# EAGLE design Scott (EAGLE 6.6.0)
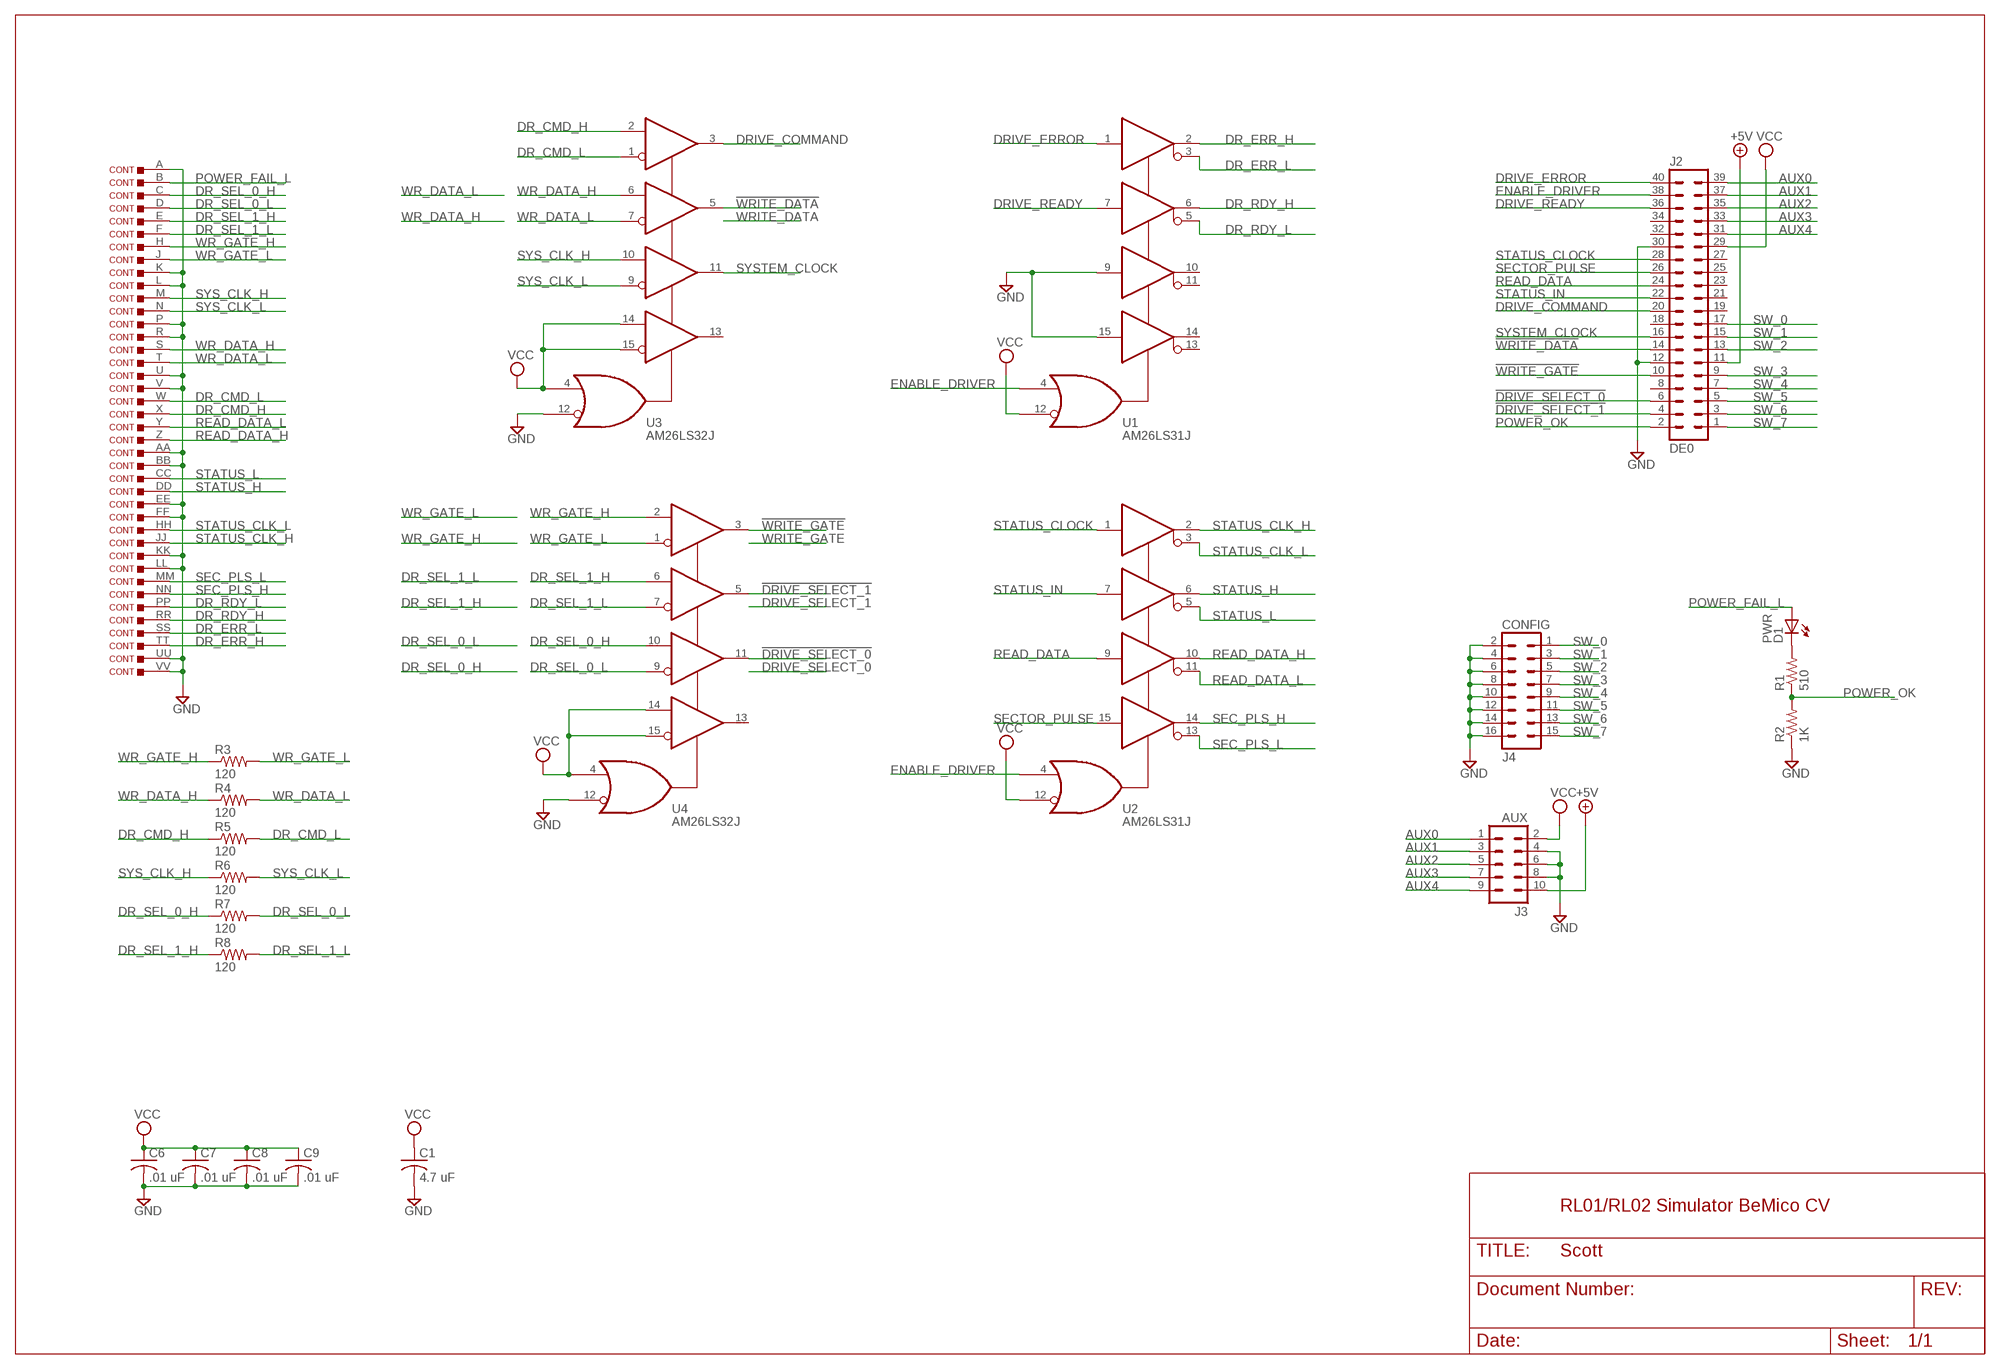
[diagram p0: schematic, sheet 1]

## Parts
C1  4.7 uF  C-USC1210K  [C1210K]
C6  .01 uF  C-USC0805  [C0805]
C7  .01 uF  C-USC0805  [C0805]
C8  .01 uF  C-USC0805  [C0805]
C9  .01 uF  C-USC0805  [C0805]
CONT  DEC40PINSV  [DEC40PINV]
D1  PWR  LEDSML0805  [SML0805]
J2  DE0  MA20-2  [MA20-2]
J3  AUX  MA05-2  [MA05-2]
J4  CONFIG  MA08-2  [MA08-2]
R1  510  R-US_M0805  [M0805]
R2  1K  R-US_M0805  [M0805]
R3  120  R-US_0204/2V  [0204V]
R4  120  R-US_0204/2V  [0204V]
R5  120  R-US_0204/2V  [0204V]
R6  120  R-US_0204/2V  [0204V]
R7  120  R-US_0204/2V  [0204V]
R8  120  R-US_0204/2V  [0204V]
U1  AM26LS31J  [SO16]
U2  AM26LS31J  [SO16]
U3  AM26LS32J  [SO16]
U4  AM26LS32J  [SO16]

## Nets
!DRIVE_SELECT_0: J2.6 U4.11(Y3)
!DRIVE_SELECT_1: J2.4 U4.5(Y2)
!WRITE_DATA: J2.14 U3.5(Y2)
!WRITE_GATE: J2.10 U4.3(Y1)
+5V: J2.11 J3.10
AUX0: J2.39 J3.1
AUX1: J2.37 J3.3
AUX2: J2.35 J3.5
AUX3: J2.33 J3.7
AUX4: J2.31 J3.9
DR_CMD_H: CONT.X R5.1 U3.2(P1)
DR_CMD_L: CONT.W R5.2 U3.1(N1)
DR_ERR_H: CONT.TT U1.2(Y1)
DR_ERR_L: CONT.SS U1.3(Z1)
DR_RDY_H: CONT.RR U1.6(Y2)
DR_RDY_L: CONT.PP U1.5(Z2)
DR_SEL_0_H: CONT.C R7.1 U4.10(P3)
DR_SEL_0_L: CONT.D R7.2 U4.9(N3)
DR_SEL_1_H: CONT.E R8.1 U4.6(P2)
DR_SEL_1_L: CONT.F R8.2 U4.7(N2)
DRIVE_COMMAND: J2.20 U3.3(Y1)
DRIVE_ERROR: J2.40 U1.1(A1)
DRIVE_READY: J2.36 U1.7(A2)
ENABLE_DRIVER: J2.38 U1.4(G) U2.4(G)
GND [supply]: C1.2 C6.2 C7.2 C8.2 C9.2 CONT.A CONT.AA CONT.BB CONT.EE CONT.FF CONT.K CONT.KK CONT.L CONT.LL CONT.P CONT.R CONT.U CONT.UU CONT.V CONT.VV J2.12 J2.30 J3.4 J3.6 J3.8 J4.2 J4.4 J4.6 J4.8 J4.10 J4.12 J4.14 J4.16 R2.1 U1.9(A3) U1.15(A4) U3.12(!G) U4.12(!G)
N$1: D1.C R1.2
POWER_FAIL_L: CONT.B D1.A
POWER_OK: J2.2 R1.1 R2.2
READ_DATA: J2.24 U2.9(A3)
READ_DATA_H: CONT.Z U2.10(Y3)
READ_DATA_L: CONT.Y U2.11(Z3)
SEC_PLS_H: CONT.NN U2.14(Y4)
SEC_PLS_L: CONT.MM U2.13(Z4)
SECTOR_PULSE: J2.26 U2.15(A4)
STATUS_CLK_H: CONT.JJ U2.2(Y1)
STATUS_CLK_L: CONT.HH U2.3(Z1)
STATUS_CLOCK: J2.28 U2.1(A1)
STATUS_H: CONT.DD U2.6(Y2)
STATUS_IN: J2.22 U2.7(A2)
STATUS_L: CONT.CC U2.5(Z2)
SW_0: J2.17 J4.1
SW_1: J2.15 J4.3
SW_2: J2.13 J4.5
SW_3: J2.9 J4.7
SW_4: J2.7 J4.9
SW_5: J2.5 J4.11
SW_6: J2.3 J4.13
SW_7: J2.1 J4.15
SYS_CLK_H: CONT.M R6.1 U3.10(P3)
SYS_CLK_L: CONT.N R6.2 U3.9(N3)
SYSTEM_CLOCK: J2.16 U3.11(Y3)
VCC [supply]: C1.1 C6.1 C7.1 C8.1 C9.1 J2.29 J3.2 U1.12(!G) U2.12(!G) U3.4(G) U3.14(P4) U3.15(N4) U4.4(G) U4.14(P4) U4.15(N4)
WR_DATA_H: CONT.S R4.1 U3.6(P2)
WR_DATA_L: CONT.T R4.2 U3.7(N2)
WR_GATE_H: CONT.H R3.1 U4.2(P1)
WR_GATE_L: CONT.J R3.2 U4.1(N1)
Unconnected: J2.8 J2.18 J2.19 J2.21 J2.23 J2.25 J2.27 J2.32 J2.34 U1.10(Y3) U1.11(Z3) U1.13(Z4) U1.14(Y4) U3.13(Y4) U4.13(Y4)

## Notes on the sheet
- RL01/RL02 Simulator BeMico CV

## Power pins joined to a net without a drawn wire
GND: U1.8(GND) U2.8(GND) U3.8(GND) U4.8(GND)
VCC: U1.16(VCC) U2.16(VCC) U3.16(VCC) U4.16(VCC)

## Library data of the parts
C1 C6-C9 = rcl:C-US: CAPACITOR, American symbol
CONT = dec-con:DEC40PINS: 40 pin ribbon connector for BC08, BC11 cables.
D1 = led:LED: LED OSRAM: - CHIPLED LG R971, LG N971, LY N971, LG Q971, LY Q971, LO R971, LY R971 LH N974, LH R974 LS Q976, LO Q976, LY Q976 LO Q996 - Hyper CHIPLED LW Q18S LB Q993, LB Q99A, LB R99A - SideLED LS A670, LO A670, LY A670, LG A670, LP A670 LB A673, LV A673, LT A673, LW A673 LH A674 LY A675 LS A676, LA A676, LO A676, LY A676, LW A676 LS A679, LY A679, LG A679 - Hyper Micro SIDELED® LS Y876, LA Y876, LO Y876, LY Y876 LT Y87S - SmartLED LW L88C, LW L88S LB L89C, LB L89S, LG L890 LS L89K, LO L89K, LY L89K LS L896, LA L896, LO L896, LY L896 - TOPLED LS T670, LO T670, LY T670, LG T670, LP T670 LSG T670, LSP T670, LSY T670, LOP T670, LYG T670 LG T671, LOG T671, LSG T671 LB T673, LV T673, LT T673, LW T673 LH T674 LS T676, LA T676, LO T676, LY T676, LB T676, LH T676, LSB T676, LW T676 LB T67C, LV T67C, LT T67C, LS T67K, LO T67K, LY T67K, LW E67C LS E67B, LA E67B, LO E67B, LY E67B, LB E67C, LV E67C, LT E67C LW T67C LS T679, LY T679, LG T679 LS T770, LO T770, LY T770, LG T770, LP T770 LB T773, LV T773, LT T773, LW T773 LH T774 LS E675, LA E675, LY E675, LS T675 LS T776, LA T776, LO T776, LY T776, LB T776 LHGB T686 LT T68C, LB T68C - Hyper Mini TOPLED® LB M676 - Mini TOPLED Santana® LG M470 LS M47K, LO M47K, LY M47K Source: http://www.osram.convergy.de LUXEON: - LUMILED® LXK2-PW12-R00, LXK2-PW12-S00, LXK2-PW14-U00, LXK2-PW14-V00 LXK2-PM12-R00, LXK2-PM12-S00, LXK2-PM14-U00 LXK2-PE12-Q00, LXK2-PE12-R00, LXK2-PE12-S00, LXK2-PE14-T00, LXK2-PE14-U00 LXK2-PB12-K00, LXK2-PB12-L00, LXK2-PB12-M00, LXK2-PB14-N00, LXK2-PB14-P00, LXK2-PB14-Q00 LXK2-PR12-L00, LXK2-PR12-M00, LXK2-PR14-Q00, LXK2-PR14-R00 LXK2-PD12-Q00, LXK2-PD12-R00, LXK2-PD12-S00 LXK2-PH12-R00, LXK2-PH12-S00 LXK2-PL12-P00, LXK2-PL12-Q00, LXK2-PL12-R00 Source: www.luxeon.com KINGBRIGHT: KA-3528ASYC Source: www.kingbright.com
J2 = con-lstb:MA20-2: PIN HEADER; OC_FARNELL: unknown; OC_NEWARK: unknown
J3 = con-lstb:MA05-2: PIN HEADER; OC_FARNELL: unknown; OC_NEWARK: unknown
J4 = con-lstb:MA08-2: PIN HEADER; OC_FARNELL: unknown; OC_NEWARK: unknown
R1-R8 = rcl:R-US_: RESISTOR, American symbol
U1 U2 = dec-con:AM26LS31: Quad RS-422 Driver
U3 U4 = dec-con:AM26LS32: Quad Differential Reciever

## Net classes
1 supply: width 0.61 mm

## Board
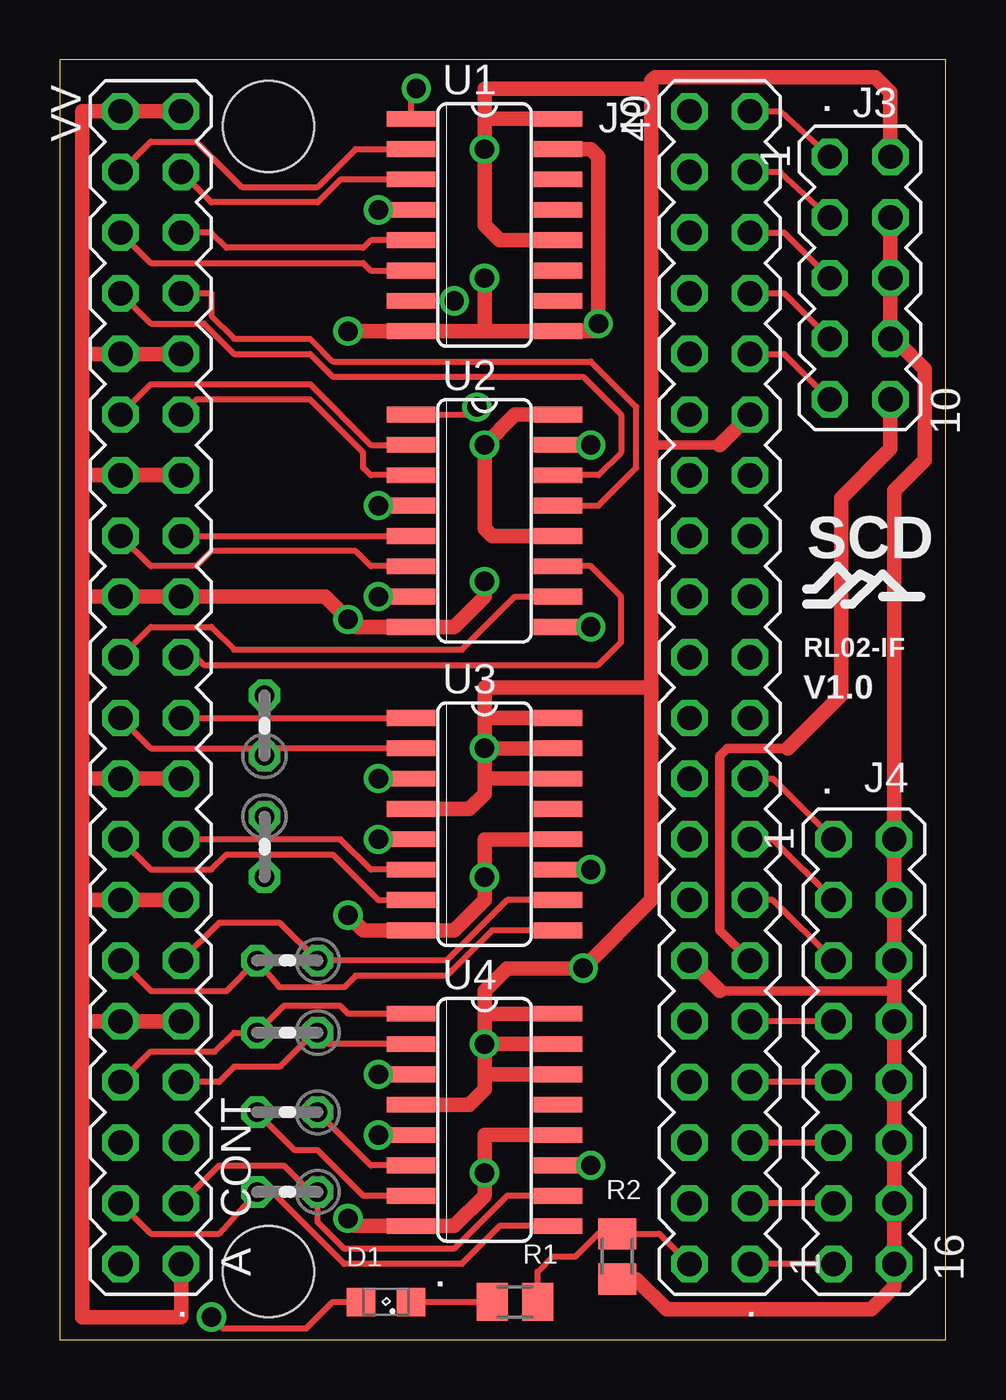
[diagram p1: board, top side]
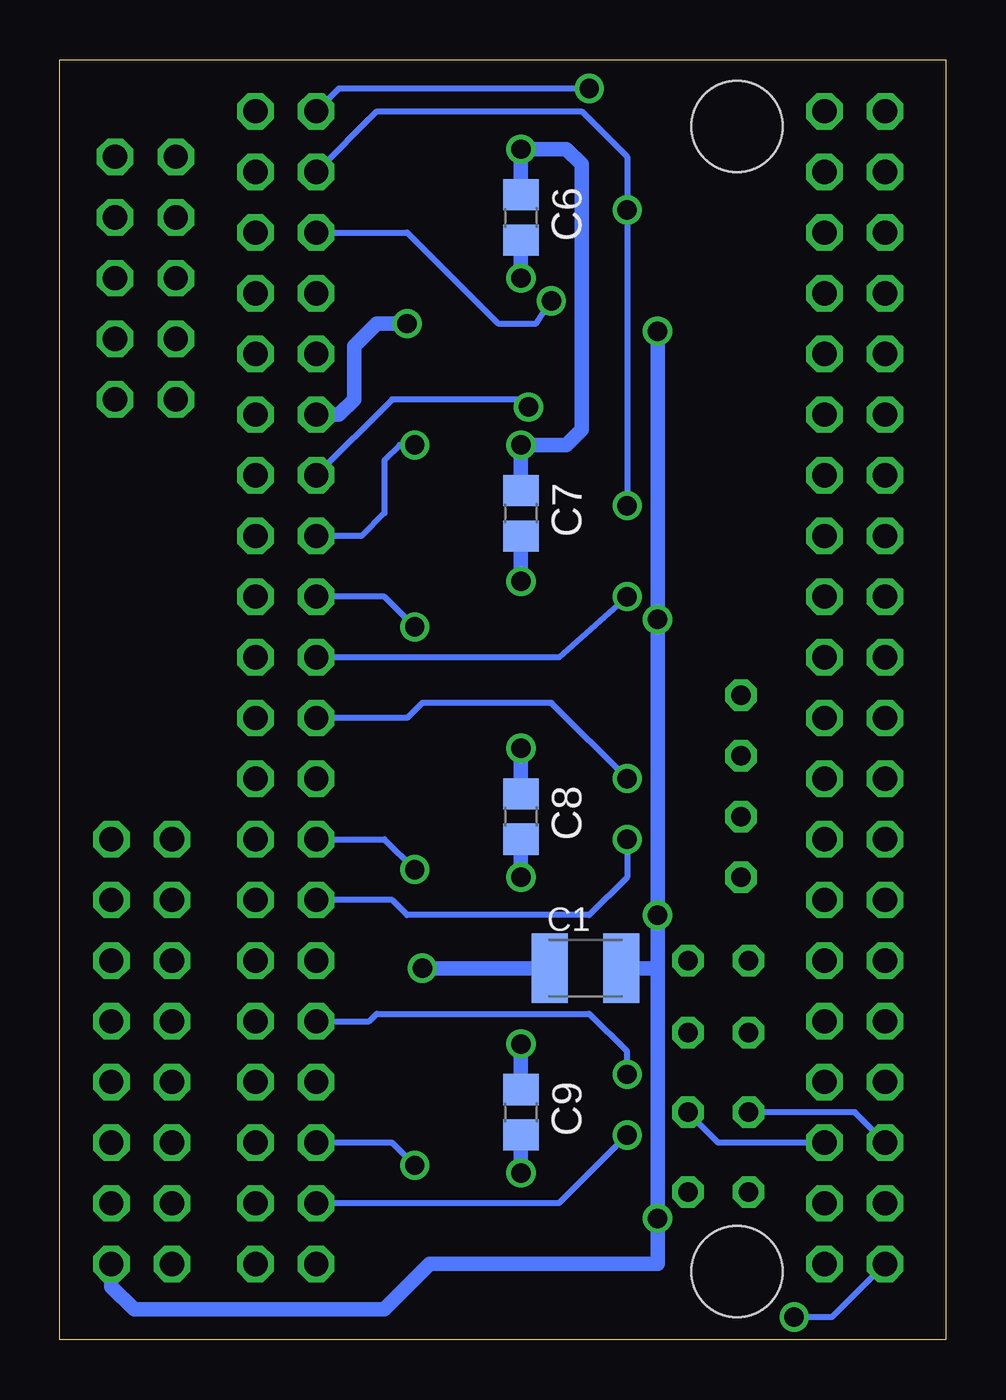
[diagram p2: board, bottom side, seen from below]

Size 37.08 x 53.59 mm. Coordinates in mm from the lower left corner, seen from the top.
Outline: 0,0 37.08,0 37.08,53.59 0,53.59 0,0
Copper layers (1+16): Top 0.035mm / dielectric 1.5mm / Bottom 0.035mm
Design rules "16mils *": minimum track width 10mil, minimum drill 32mil, track to track 6mil, track to pad 10mil, pad to pad 10mil, via to via 10mil, smd to smd 0mil, copper to edge 13mil, drill to drill 10mil, minimum pad ring 10mil, minimum via ring 8mil, stop-mask expansion 0mil, vias tented up to drill 0mil, thermal gap 10mil
Holes 3.81 mm at 8.73,50.8 8.73,2.86

### Footprints (pad centres in the part's own frame; a part is rotated, then mirrored left to right if it is on the bottom)
C1210K = smd 1.5 x 2.9: 1 -1.5,0; 2 1.5,0
C0805 = smd 1.3 x 1.5: 1 -0.95,0; 2 0.95,0
DEC40PINV = drill 1.016 octagon: A -24.13,-1.27; AA 3.81,-1.27; B -24.13,1.27; BB 3.81,1.27; C -21.59,-1.27; CC 6.35,-1.27; D -21.59,1.27; DD 6.35,1.27; E -19.05,-1.27; EE 8.89,-1.27; F -19.05,1.27; FF 8.89,1.27; H -16.51,-1.27; HH 11.43,-1.27; J -16.51,1.27; JJ 11.43,1.27; K -13.97,-1.27; KK 13.97,-1.27; L -13.97,1.27; LL 13.97,1.27; M -11.43,-1.27; MM 16.51,-1.27; N -11.43,1.27; NN 16.51,1.27; P -8.89,-1.27; PP 19.05,-1.27; R -8.89,1.27; RR 19.05,1.27; S -6.35,-1.27; SS 21.59,-1.27; T -6.35,1.27; TT 21.59,1.27; U -3.81,-1.27; UU 24.13,-1.27; V -3.81,1.27; VV 24.13,1.27; W -1.27,-1.27; X -1.27,1.27; Y 1.27,-1.27; Z 1.27,1.27
SML0805 = smd 1.2 x 1.2: A 1.05,0; C -1.05,0
MA20-2 = drill 1.016 octagon: 1 -24.13,-1.27; 2 -24.13,1.27; 3 -21.59,-1.27; 4 -21.59,1.27; 5 -19.05,-1.27; 6 -19.05,1.27; 7 -16.51,-1.27; 8 -16.51,1.27; 9 -13.97,-1.27; 10 -13.97,1.27; 11 -11.43,-1.27; 12 -11.43,1.27; 13 -8.89,-1.27; 14 -8.89,1.27; 15 -6.35,-1.27; 16 -6.35,1.27; 17 -3.81,-1.27; 18 -3.81,1.27; 19 -1.27,-1.27; 20 -1.27,1.27; 21 1.27,-1.27; 22 1.27,1.27; 23 3.81,-1.27; 24 3.81,1.27; 25 6.35,-1.27; 26 6.35,1.27; 27 8.89,-1.27; 28 8.89,1.27; 29 11.43,-1.27; 30 11.43,1.27; 31 13.97,-1.27; 32 13.97,1.27; 33 16.51,-1.27; 34 16.51,1.27; 35 19.05,-1.27; 36 19.05,1.27; 37 21.59,-1.27; 38 21.59,1.27; 39 24.13,-1.27; 40 24.13,1.27
MA05-2 = drill 1.016 octagon: 1 -5.08,-1.27; 2 -5.08,1.27; 3 -2.54,-1.27; 4 -2.54,1.27; 5 0,-1.27; 6 0,1.27; 7 2.54,-1.27; 8 2.54,1.27; 9 5.08,-1.27; 10 5.08,1.27
MA08-2 = drill 1.016 octagon: 1 -8.89,-1.27; 2 -8.89,1.27; 3 -6.35,-1.27; 4 -6.35,1.27; 5 -3.81,-1.27; 6 -3.81,1.27; 7 -1.27,-1.27; 8 -1.27,1.27; 9 1.27,-1.27; 10 1.27,1.27; 11 3.81,-1.27; 12 3.81,1.27; 13 6.35,-1.27; 14 6.35,1.27; 15 8.89,-1.27; 16 8.89,1.27
M0805 = smd 1.3 x 1.6: 1 -0.95,0; 2 0.95,0
0204V = drill 0.813 octagon: 1 -1.27,0; 2 1.27,0
SO16 = smd 0.66 x 2.032: 1 -4.445,-3.073; 2 -3.175,-3.073; 3 -1.905,-3.073; 4 -0.635,-3.073; 5 0.635,-3.073; 6 1.905,-3.073; 7 3.175,-3.073; 8 4.445,-3.073; 9 4.445,3.073; 10 3.175,3.073; 11 1.905,3.073; 12 0.635,3.073; 13 -0.635,3.073; 14 -1.905,3.073; 15 -3.175,3.073; 16 -4.445,3.073

### Placement (x,y rotation side)
C1  15.08,15.56 0 bottom
C6  17.78,46.99 270 bottom
C7  17.78,34.61 270 bottom
C8  17.78,21.91 270 bottom
C9  17.78,9.53 270 bottom
CONT  3.81,27.3 90 top
D1  13.65,1.59 180 top
J2  27.62,27.3 90 top
J3  33.5,44.45 270 top
J4  33.66,12.06 270 top
R1  19.05,1.59 180 top
R2  23.34,3.49 90 top
R3  9.53,12.86 180 top
R4  8.57,20.64 270 top
R5  8.57,25.72 90 top
R6  9.53,15.88 180 top
R7  9.53,6.19 180 top
R8  9.53,9.53 180 top
U1  17.78,46.67 270 top
U2  17.78,34.29 270 top
U3  17.78,21.59 270 top
U4  17.78,9.21 270 top

### Tracks (layer width: path | path; a pad name or v marks a point on that pad's centre or on a via)
!DRIVE_SELECT_0  (via drill 0.81)
  Top 0.254: U4.11 v22.23,7.3
  Bottom 0.254: v22.23,7.3 23.18,8.26 J2.6
!DRIVE_SELECT_1  (via drill 0.81)
  Top 0.254: U4.5 v13.34,8.57
  Bottom 0.254: v13.34,8.57 16.19,5.71 J2.4
!WRITE_DATA  (via drill 0.81)
  Top 0.254: U3.5 v13.34,20.95
  Bottom 0.254: v13.34,20.95 13.34,19.37 14.92,17.78 22.54,17.78 23.18,18.41 J2.14
!WRITE_GATE  (via drill 0.81)
  Top 0.254: U4.3 v13.34,11.11
  Bottom 0.254: J2.10 24.13,13.34 23.81,13.65 14.92,13.65 13.34,12.06 v13.34,11.11
+5V
  Top 0.406: 30.48,24.77 27.94,24.77 27.62,24.45 27.62,17.14 J2.11
  Top 0.61: J3.10 34.77,37.31 32.7,35.24 32.7,26.99 30.48,24.77
AUX0
  Top 0.254: J2.39 30.16,51.44 J3.1
AUX1
  Top 0.254: J3.3 30.16,48.9 J2.37
AUX2
  Top 0.254: J2.35 30.32,46.35 J3.5
AUX3
  Top 0.254: J2.33 30.32,43.81 J3.7
AUX4
  Top 0.254: J2.31 30.32,41.27 J3.9
DR_CMD_H
  Top 0.254: CONT.X 3.81,24.77 8.57,24.77 | R5.1 8.57,24.77 | U3.2 8.57,24.77
DR_CMD_L
  Top 0.254: CONT.W 8.57,26.04 | R5.2 8.57,26.04 | 8.57,26.04 U3.1
DR_ERR_H
  Top 0.254: CONT.TT 3.81,50.16 5.71,50.16 7.62,48.26 10.79,48.26 12.38,49.85 U1.2
DR_ERR_L
  Top 0.254: U1.3 11.75,48.58 10.79,47.62 6.35,47.62 CONT.SS
DR_RDY_H
  Top 0.254: CONT.RR 3.81,45.09 12.7,45.09 13.02,44.77 U1.6
DR_RDY_L
  Top 0.254: U1.5 13.02,46.04 12.7,45.72 6.99,45.72 6.35,46.35 CONT.PP
DR_SEL_0_H
  Top 0.254: CONT.C 6.67,7.3 9.37,7.3 10.48,6.19 R7.1 10.79,4.92 11.91,3.81 16.51,3.81 18.73,6.03 U4.10
DR_SEL_0_L
  Top 0.254: CONT.D 3.81,4.45 6.67,4.45 R7.2 8.89,6.19 11.91,3.17 16.83,3.17 18.41,4.76 U4.9
DR_SEL_1_H
  Top 0.254: U4.6 13.02,7.3 R8.1
  Bottom 0.254: CONT.E 9.53,8.26 R8.1
DR_SEL_1_L
  Top 0.254: U4.7 12.7,6.03 10.79,7.94 9.84,7.94 R8.2
  Bottom 0.254: CONT.F 3.81,9.53 R8.2
DRIVE_COMMAND  (via drill 0.81)
  Top 0.254: U3.3 v13.34,23.5
  Bottom 0.254: v13.34,23.5 16.51,26.67 21.91,26.67 22.54,26.04 J2.20
DRIVE_ERROR  (via drill 0.81)
  Top 0.254: U1.1 14.71,51.85 14.92,52.07 v14.92,52.39
  Bottom 0.254: v14.92,52.39 25.4,52.39 J2.40
DRIVE_READY  (via drill 0.81)
  Top 0.254: v16.51,43.5 U1.7
  Bottom 0.254: J2.36 22.54,46.35 18.73,42.55 17.14,42.55 v16.51,43.5
ENABLE_DRIVER  (via drill 0.81)
  Top 0.254: U1.4 v13.34,47.31 | v13.34,34.92 U2.4
  Bottom 0.254: v13.34,34.92 v13.34,47.31 13.34,49.53 15.24,51.44 23.81,51.44 J2.38
GND  (via drill 0.81)
  Top 0.406: 27.62,14.61 34.92,14.61
  Top 0.61: CONT.A 5.08,0.95 0.95,0.95 0.95,13.34 | 0.95,13.34 CONT.L CONT.K | CONT.U CONT.V 0.95,23.5 | CONT.EE CONT.FF 0.95,36.2 | CONT.KK CONT.LL 0.95,41.27 | CONT.UU CONT.VV 0.95,51.44 0.95,41.27 | 0.95,41.27 0.95,36.2 | 0.95,36.2 0.95,31.11 | 0.95,31.11 0.95,23.5 | 0.95,23.5 0.95,18.41 | 0.95,18.41 0.95,13.34 | CONT.P CONT.R 0.95,18.41 | 0.95,31.11 CONT.BB CONT.AA 11.11,31.11 v12.06,30.16 12.38,29.84 U2.8 16.51,29.84 17.78,31.11 v17.78,31.75 | J3.4 J3.6 J3.8 34.92,41.91 36.2,40.64 36.2,36.83 34.92,35.56 J4.2 J4.4 J4.6 34.92,14.61 J4.8 J4.10 J4.12 J4.14 J4.16 34.92,2.22 33.97,1.27 25.4,1.27 24.13,2.54 R2.1 | v12.06,42.23 U1.8 17.78,42.23 | U4.12 C9.2 v17.78,6.99 17.78,6.03 16.51,4.76 U4.8 12.38,4.76 v12.06,5.08 | v12.06,17.78 12.7,17.14 U3.8 16.51,17.14 17.78,18.41 v17.78,19.37 C8.2 U3.12 | J2.12 27.62,14.61 | 17.78,42.23 v17.78,44.45 | U1.15 22.23,49.85 22.54,49.53 v22.54,42.55 22.54,42.23 U1.9 17.78,42.23
  Bottom 0.61: C1.2 12.06,15.56 | 12.06,15.56 v12.06,5.08 12.06,3.17 21.59,3.17 23.5,1.27 33.97,1.27 34.92,2.22 J4.16 | v12.06,42.23 v12.06,30.16 v12.06,17.78 12.06,15.56 | C9.2 v17.78,6.99 | v17.78,19.37 C8.2 | v17.78,31.75 C7.2 | v17.78,44.45 C6.2 | J2.30 25.4,38.73 24.77,39.37 24.77,41.59 23.81,42.55 v22.54,42.55
N$1
  Top 0.254: D1.C R1.2
POWER_FAIL_L  (via drill 0.81)
  Top 0.254: v6.35,0.95 6.83,0.48 10.32,0.48 11.43,1.59 D1.A
  Bottom 0.254: CONT.B 4.76,0.95 v6.35,0.95
POWER_OK
  Top 0.254: R1.1 20,2.85 20.64,3.49 21.59,3.49 22.54,4.45 R2.2 25.09,4.44 J2.2
READ_DATA  (via drill 0.81)
  Top 0.254: U2.9 v22.23,29.84
  Bottom 0.254: v22.23,29.84 23.5,31.11 J2.24
READ_DATA_H
  Top 0.254: CONT.Z 3.81,29.84 6.35,29.84 7.3,28.89 16.83,28.89 19.05,31.11 U2.10
READ_DATA_L
  Top 0.254: CONT.Y 5.71,28.57 6.03,28.26 22.54,28.26 23.5,29.21 23.5,31.11 22.23,32.38 U2.11
SEC_PLS_H
  Top 0.254: CONT.NN 3.81,42.55 6.03,42.55 7.3,41.27 10.48,41.27 11.43,40.32 21.91,40.32 23.5,38.73 23.5,37.15 22.54,36.2 U2.14
SEC_PLS_L
  Top 0.254: CONT.MM 6.35,43.81 6.35,42.86 7.3,41.91 10.48,41.91 11.43,40.96 22.23,40.96 24.13,39.05 24.13,36.51 22.54,34.92 U2.13
SECTOR_PULSE  (via drill 0.81)
  Top 0.254: U2.15 v22.23,37.47
  Bottom 0.254: v22.23,37.47 22.86,37.47 23.5,36.83 23.5,34.61 24.45,33.66 J2.26
STATUS_CLK_H
  Top 0.254: CONT.JJ 3.81,40.01 10.48,40.01 13.02,37.47 U2.2
STATUS_CLK_L
  Top 0.254: U2.3 13.02,36.2 12.7,36.51 12.7,37.15 10.48,39.37 5.71,39.37 CONT.HH
STATUS_CLOCK  (via drill 0.81)
  Top 0.254: U2.1 17.14,38.73 v17.46,39.05
  Bottom 0.254: v17.46,39.05 17.78,39.37 23.18,39.37 J2.28
STATUS_H
  Top 0.254: U2.6 13.02,32.38 12.38,33.02 6.35,33.02 5.71,32.38 3.81,32.38 CONT.DD
STATUS_IN  (via drill 0.81)
  Top 0.254: U2.7 v13.34,31.11
  Bottom 0.254: v13.34,31.11 16.19,28.57 J2.22
STATUS_L
  Top 0.254: CONT.CC U2.5
SW_0
  Top 0.254: J2.17 29.84,23.5 J4.1
SW_1
  Top 0.254: J4.3 29.84,20.95 J2.15
SW_2
  Top 0.254: J4.5 29.84,18.41 J2.13
SW_3
  Top 0.254: J4.7 J2.9
SW_4
  Top 0.254: J4.9 J2.7
SW_5
  Top 0.254: J4.11 J2.5
SW_6
  Top 0.254: J4.13 J2.3
SW_7
  Top 0.254: J4.15 J2.1
SYS_CLK_H
  Top 0.254: U3.10 18.73,18.41 16.19,15.88 R6.1 9.21,17.46 6.67,17.46 CONT.M
SYS_CLK_L
  Top 0.254: U3.9 18.1,17.14 16.19,15.24 12.38,15.24 11.91,14.76 9.21,14.76 R6.2 6.99,14.61 3.81,14.61 CONT.N
SYSTEM_CLOCK  (via drill 0.81)
  Top 0.254: v22.23,19.68 U3.11
  Bottom 0.254: J2.16 23.5,20.95 v22.23,19.68
VCC  (via drill 0.81)
  Top 0.406: 27.62,37.47 24.77,37.47
  Top 0.61: U4.4 17.15,9.84 C9.1 17.78,11.11 | J3.2 34.77,52.23 34.13,52.86 24.92,52.86 24.77,52.7 24.77,52.39 | 24.77,52.39 24.77,37.47 24.77,27.3 | 24.77,27.3 24.77,18.41 v21.91,15.56 18.73,15.56 17.78,14.61 17.78,13.65 | 17.78,13.65 v17.78,12.38 | 17.78,11.11 v17.78,12.38 | U3.16 17.78,26.04 | 17.78,26.04 v17.78,24.77 | 17.78,26.04 17.78,27.3 24.77,27.3 | U4.16 17.78,13.65 | U4.14 17.78,11.11 | U4.15 v17.78,12.38 | J2.29 27.62,37.47 | U3.14 17.78,23.5 | 17.78,23.5 v17.78,24.77 | U3.4 17.15,22.23 C8.1 17.78,23.5 | U3.15 v17.78,24.77 | U2.12 18.1,33.66 17.78,33.97 v17.78,37.47 19.05,38.73 U2.16 | 17.78,51.12 v17.78,49.85 17.78,46.67 18.41,46.04 U1.12 | 17.78,51.12 17.78,52.39 24.77,52.39 | U1.16 17.78,51.12
  Bottom 0.61: v17.78,12.38 C9.1 | v17.78,24.77 C8.1 | C7.1 v17.78,37.47 15.88,37.47 15.24,38.1 15.24,49.21 15.88,49.85 v17.78,49.85 C6.1 | C1.1 v21.91,15.56
WR_DATA_H
  Top 0.254: U3.6 13.02,19.68 11.75,20.95 8.57,20.95 | CONT.S 8.41,20.95 8.57,20.95 | R4.1 8.57,20.95
WR_DATA_L
  Top 0.254: CONT.T 3.81,19.68 6.35,19.68 6.99,20.32 8.57,20.32 | 8.57,20.32 11.43,20.32 13.34,18.41 U3.7 | R4.2 8.57,20.32
WR_GATE_H
  Top 0.254: U4.2 11.27,12.38 R3.1 10.64,12.86 9.21,11.43 7.3,11.43 6.67,10.79 CONT.H
WR_GATE_L
  Top 0.254: CONT.J 3.81,12.06 6.51,12.06 7.3,12.86 R3.2 9.37,13.97 11.75,13.97 12.06,13.65 U4.1

### Text on the board
tNames: . | SCD | RL02-IF | V1.0 | . | . | . | .